# Altium schematic sheet TopLevel.SchDoc
size Tabloid; DrawnBy: V-P.Rheaume@USherbrooke.ca; DocumentNumber: 1; Revision: 1; SheetNumber: 1; SheetTotal: 11; SheetName: Top level
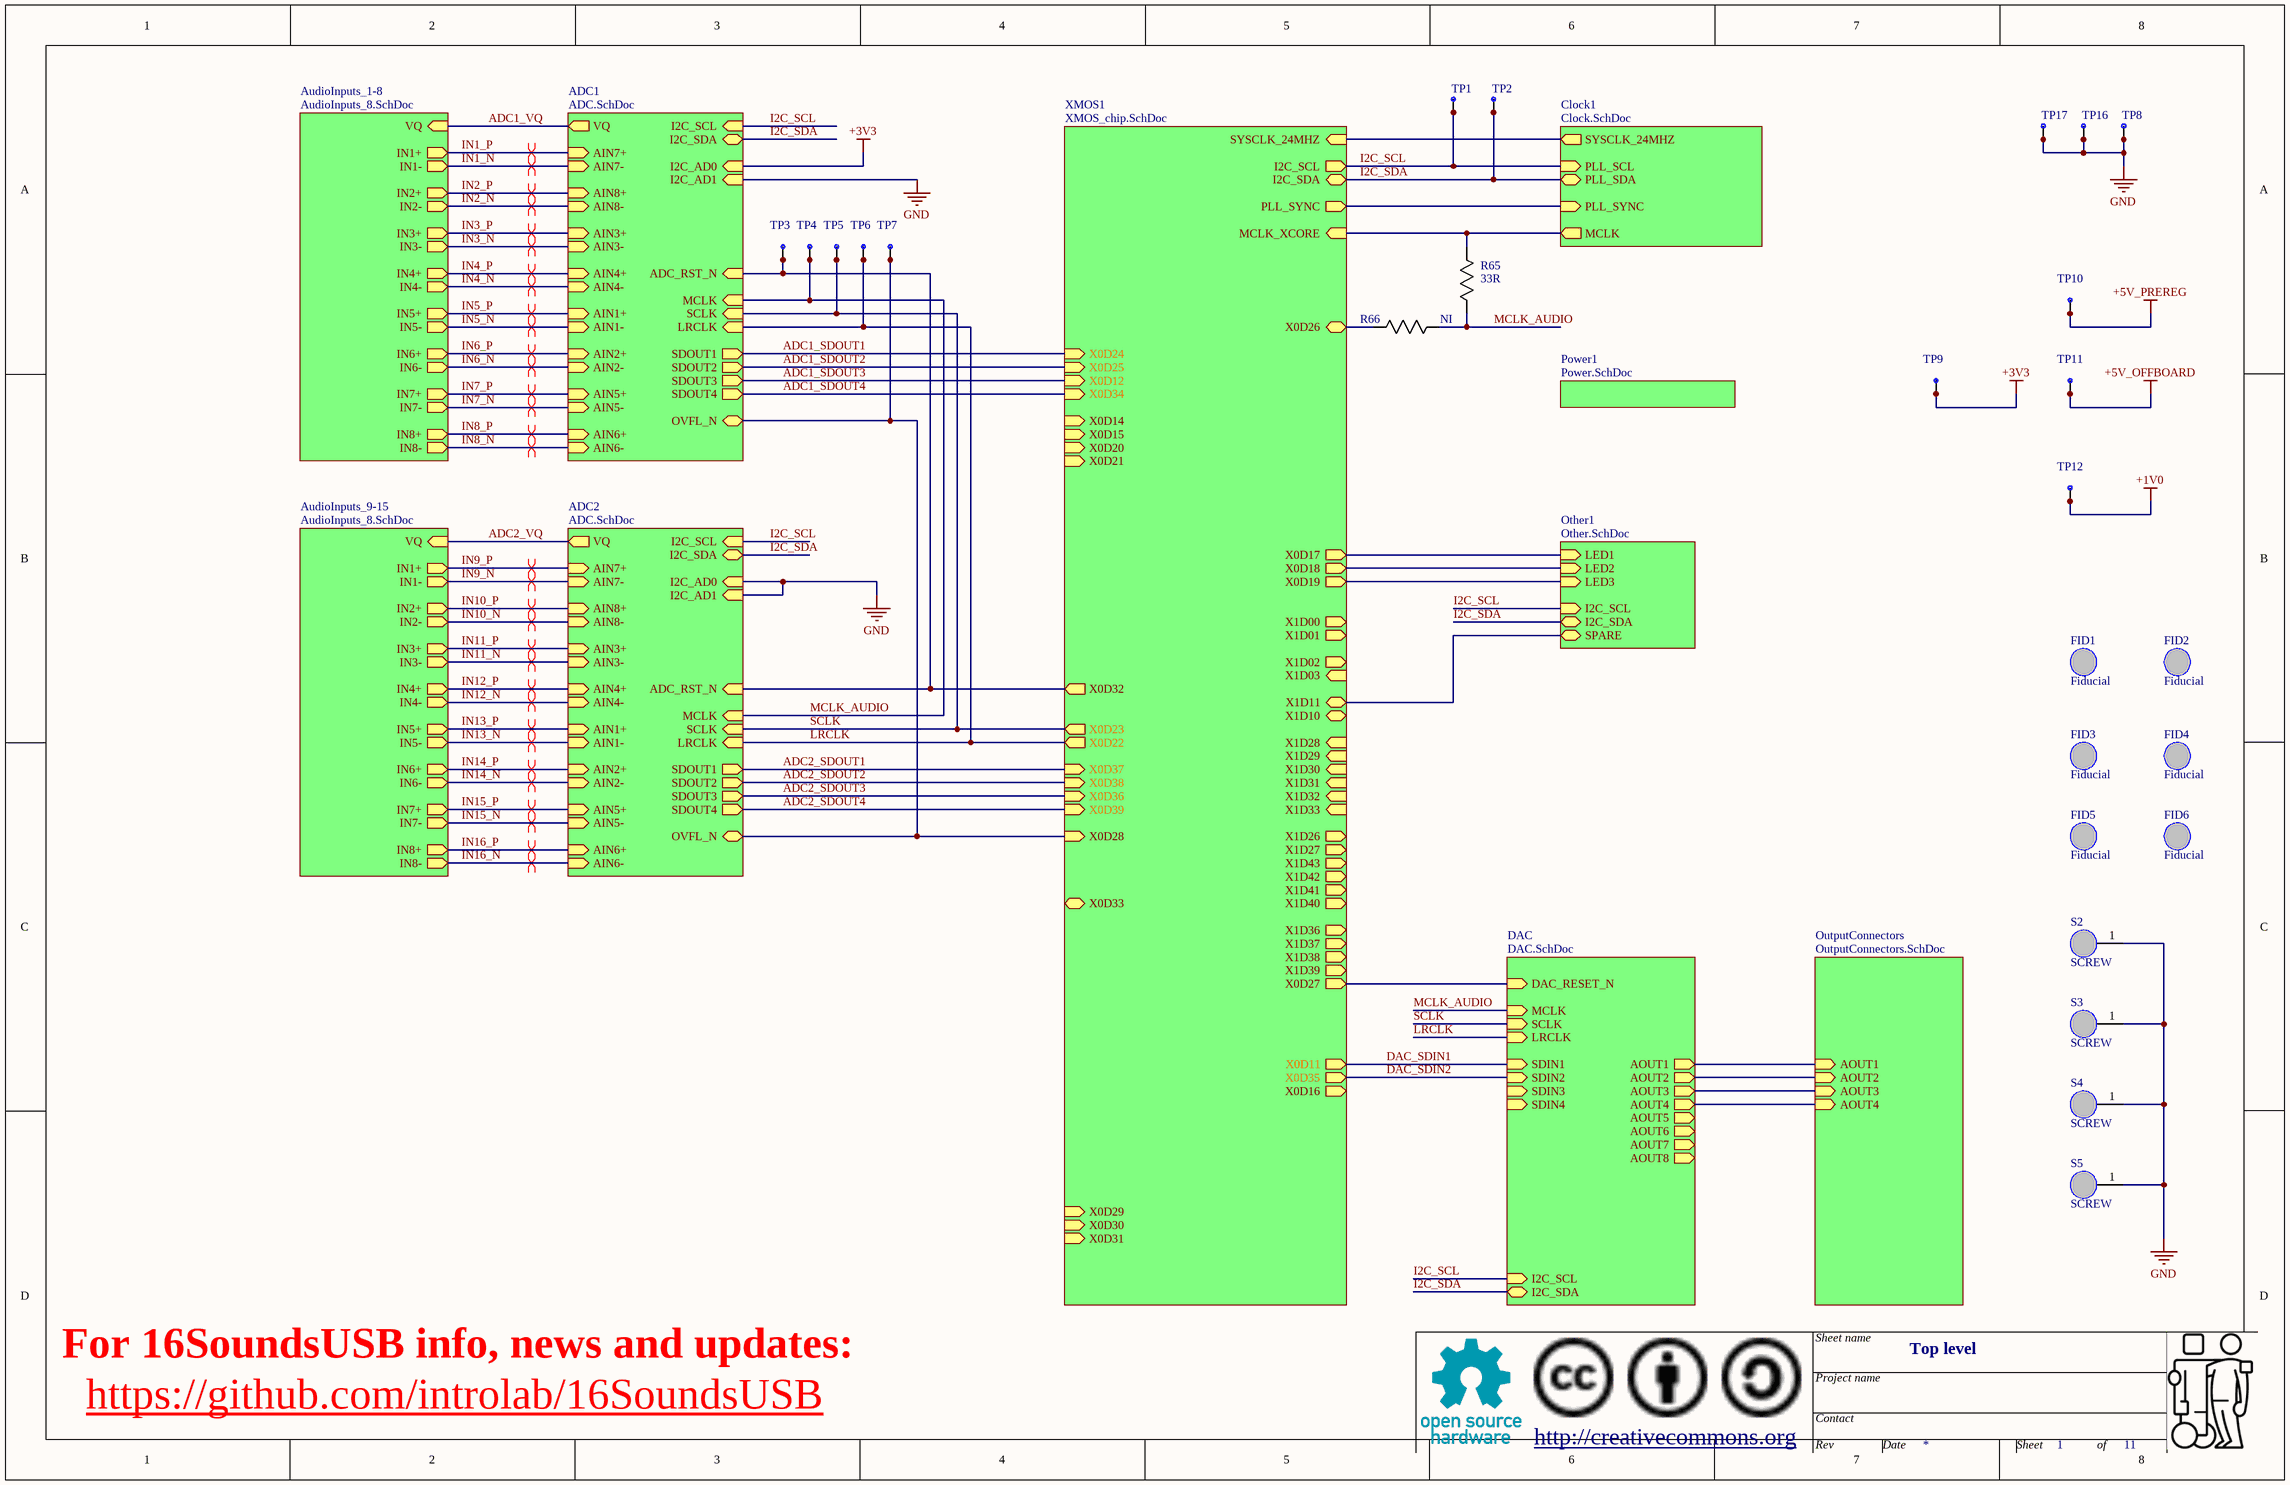
[diagram p0: TopLevel.SchDoc]

## Parts
FID1  Fiducial  [FIDUCIAL]
FID2  Fiducial  [FIDUCIAL]
FID3  Fiducial  [FIDUCIAL]
FID4  Fiducial  [FIDUCIAL]
FID5  Fiducial  [FIDUCIAL]
FID6  Fiducial  [FIDUCIAL]
R65  value 33R  [0603]  (hidden comment: Resistor)
R66  Resistor  [0603]  (value not drawn)
S2  SCREW  [SCREW_4_40]
S3  SCREW  [SCREW_4_40]
S4  SCREW  [SCREW_4_40]
S5  SCREW  [SCREW_4_40]
TP1  TESTPOINT  [0603]  (value not drawn)
TP2  TESTPOINT  [0603]  (value not drawn)
TP3  TESTPOINT  [0603]  (value not drawn)
TP4  TESTPOINT  [0603]  (value not drawn)
TP5  TESTPOINT  [0603]  (value not drawn)
TP6  TESTPOINT  [0603]  (value not drawn)
TP7  TESTPOINT  [0603]  (value not drawn)
TP8  TESTPOINT  [1206]  (value not drawn)
TP9  TESTPOINT  [0603]  (value not drawn)
TP10  TESTPOINT  [0603]  (value not drawn)
TP11  TESTPOINT  [0603]  (value not drawn)
TP12  TESTPOINT  [0603]  (value not drawn)
TP16  TESTPOINT  [1206]  (value not drawn)
TP17  TESTPOINT  [1206]  (value not drawn)

## Sub-sheets
ADC1 = ADC.SchDoc: I2C_SCL (in), I2C_SDA (bidir), I2C_AD1 (in), I2C_AD0 (in), SDOUT1 (out), SDOUT2 (out), SDOUT3 (out), SDOUT4 (out), LRCLK (in), SCLK (in), MCLK (in), ADC_RST_N (in), OVFL_N (bidir), AIN1+ (in), AIN1- (in), AIN2+ (in), AIN2- (in), AIN3+ (in), AIN3- (in), AIN4+ (in), AIN4- (in), AIN5+ (in), AIN5- (in), AIN6+ (in), AIN6- (in), AIN7+ (in), AIN7- (in), AIN8+ (in), AIN8- (in), VQ (out)
ADC2 = ADC.SchDoc: I2C_SCL (in), I2C_SDA (bidir), I2C_AD1 (in), I2C_AD0 (in), SDOUT1 (out), SDOUT2 (out), SDOUT3 (out), SDOUT4 (out), LRCLK (in), SCLK (in), MCLK (in), ADC_RST_N (in), OVFL_N (bidir), AIN1+ (in), AIN1- (in), AIN2+ (in), AIN2- (in), AIN3+ (in), AIN3- (in), AIN4+ (in), AIN4- (in), AIN5+ (in), AIN5- (in), AIN6+ (in), AIN6- (in), AIN7+ (in), AIN7- (in), AIN8+ (in), AIN8- (in), VQ (out)
AudioInputs_1-8 = AudioInputs_8.SchDoc: VQ (in), IN8+ (out), IN8- (out), IN1+ (out), IN1- (out), IN2+ (out), IN2- (out), IN3+ (out), IN3- (out), IN4+ (out), IN4- (out), IN5+ (out), IN5- (out), IN6+ (out), IN6- (out), IN7+ (out), IN7- (out)
AudioInputs_9-15 = AudioInputs_8.SchDoc: VQ (in), IN8+ (out), IN8- (out), IN1+ (out), IN1- (out), IN2+ (out), IN2- (out), IN3+ (out), IN3- (out), IN4+ (out), IN4- (out), IN5+ (out), IN5- (out), IN6+ (out), IN6- (out), IN7+ (out), IN7- (out)
Clock1 = Clock.SchDoc: SYSCLK_24MHZ (out), PLL_SYNC (in), PLL_SCL (in), PLL_SDA (bidir), MCLK (out)
DAC = DAC.SchDoc: LRCLK (in), SCLK (in), MCLK (in), SDIN1 (in), SDIN2 (in), SDIN3 (in), SDIN4 (in), DAC_RESET_N (in), I2C_SCL (in), I2C_SDA (bidir), AOUT1 (out), AOUT2 (out), AOUT3 (out), AOUT4 (out), AOUT5 (out), AOUT6 (out), AOUT7 (out), AOUT8 (out)
Other1 = Other.SchDoc: LED1 (in), LED2 (in), LED3 (in), I2C_SCL (in), I2C_SDA (bidir), SPARE (bidir)
OutputConnectors = OutputConnectors.SchDoc: AOUT1 (in), AOUT2 (in), AOUT3 (in), AOUT4 (in)
Power1 = Power.SchDoc: no entries
XMOS1 = XMOS_chip.SchDoc: SYSCLK_24MHZ (in), MCLK_XCORE (in), I2C_SCL (out), I2C_SDA (bidir), PLL_SYNC (out), X0D14 (in), X0D15 (in), X0D16 (out), X0D17 (out), X0D18 (out), X0D19 (out), X0D20 (in), X0D21 (in), X0D22 (out), X0D23 (out), X0D24 (in), X0D25 (in), X0D27 (out), X0D32 (out), X0D34 (in), X0D35 (out), X0D36 (in), X0D37 (in), X0D38 (in), X0D39 (in), X0D29 (in), X0D28 (in), X0D31 (in), X0D30 (in), X0D33 (bidir), X0D26 (bidir), X1D26 (out), X1D27 (out), X1D28 (in), X1D29 (in), X1D30 (in), X1D31 (in), X1D32 (in), X1D33 (in), X1D43 (out), X1D42 (out), X1D41 (out), X1D40 (out), X1D10 (bidir), X1D11 (bidir), X1D03 (in), X1D02 (out), X1D01 (out), X1D00 (out), X1D37 (out), X1D36 (out), X1D39 (out), X1D38 (out), X0D12 (in), X0D11 (out)

## Nets
+1V0: TP12.1 TP12.2
+3V3: TP9.1 TP9.2 ; sheet ADC1/I2C_AD0
+5V_OFFBOARD: TP11.1 TP11.2
+5V_PREREG: TP10.1 TP10.2
GND: S2.1 S3.1 S4.1 S5.1 TP8.1 TP8.2 TP16.1 TP16.2 TP17.1 TP17.2 ; sheet ADC2/I2C_AD1, sheet ADC2/I2C_AD0, sheet ADC1/I2C_AD1
ADC1_SDOUT1: sheet XMOS1/X0D24, sheet ADC1/SDOUT1
ADC1_SDOUT2: sheet XMOS1/X0D25, sheet ADC1/SDOUT2
ADC1_SDOUT3: sheet XMOS1/X0D12, sheet ADC1/SDOUT3
ADC1_SDOUT4: sheet XMOS1/X0D34, sheet ADC1/SDOUT4
ADC1_VQ: sheet AudioInputs_1-8/VQ, sheet ADC1/VQ
ADC2_SDOUT1: sheet XMOS1/X0D37, sheet ADC2/SDOUT1
ADC2_SDOUT2: sheet XMOS1/X0D38, sheet ADC2/SDOUT2
ADC2_SDOUT3: sheet XMOS1/X0D36, sheet ADC2/SDOUT3
ADC2_SDOUT4: sheet XMOS1/X0D39, sheet ADC2/SDOUT4
ADC2_VQ: sheet AudioInputs_9-15/VQ, sheet ADC2/VQ
DAC_SDIN1: sheet XMOS1/X0D11, sheet DAC/SDIN1
DAC_SDIN2: sheet XMOS1/X0D35, sheet DAC/SDIN2
I2C_SCL: TP1.1 TP1.2 ; sheet XMOS1/I2C_SCL, sheet Clock1/PLL_SCL, sheet ADC2/I2C_SCL, sheet ADC1/I2C_SCL, sheet DAC/I2C_SCL, sheet Other1/I2C_SCL
I2C_SDA: TP2.1 TP2.2 ; sheet XMOS1/I2C_SDA, sheet Clock1/PLL_SDA, sheet ADC2/I2C_SDA, sheet ADC1/I2C_SDA, sheet DAC/I2C_SDA, sheet Other1/I2C_SDA
IN1_N: sheet AudioInputs_1-8/IN1-, sheet ADC1/AIN7-
IN1_P: sheet AudioInputs_1-8/IN1+, sheet ADC1/AIN7+
IN2_N: sheet AudioInputs_1-8/IN2-, sheet ADC1/AIN8-
IN2_P: sheet AudioInputs_1-8/IN2+, sheet ADC1/AIN8+
IN3_N: sheet AudioInputs_1-8/IN3-, sheet ADC1/AIN3-
IN3_P: sheet AudioInputs_1-8/IN3+, sheet ADC1/AIN3+
IN4_N: sheet AudioInputs_1-8/IN4-, sheet ADC1/AIN4-
IN4_P: sheet AudioInputs_1-8/IN4+, sheet ADC1/AIN4+
IN5_N: sheet AudioInputs_1-8/IN5-, sheet ADC1/AIN1-
IN5_P: sheet AudioInputs_1-8/IN5+, sheet ADC1/AIN1+
IN6_N: sheet AudioInputs_1-8/IN6-, sheet ADC1/AIN2-
IN6_P: sheet AudioInputs_1-8/IN6+, sheet ADC1/AIN2+
IN7_N: sheet AudioInputs_1-8/IN7-, sheet ADC1/AIN5-
IN7_P: sheet AudioInputs_1-8/IN7+, sheet ADC1/AIN5+
IN8_N: sheet AudioInputs_1-8/IN8-, sheet ADC1/AIN6-
IN8_P: sheet AudioInputs_1-8/IN8+, sheet ADC1/AIN6+
IN9_N: sheet AudioInputs_9-15/IN1-, sheet ADC2/AIN7-
IN9_P: sheet AudioInputs_9-15/IN1+, sheet ADC2/AIN7+
IN10_N: sheet AudioInputs_9-15/IN2-, sheet ADC2/AIN8-
IN10_P: sheet AudioInputs_9-15/IN2+, sheet ADC2/AIN8+
IN11_N: sheet AudioInputs_9-15/IN3-, sheet ADC2/AIN3-
IN11_P: sheet AudioInputs_9-15/IN3+, sheet ADC2/AIN3+
IN12_N: sheet AudioInputs_9-15/IN4-, sheet ADC2/AIN4-
IN12_P: sheet AudioInputs_9-15/IN4+, sheet ADC2/AIN4+
IN13_N: sheet AudioInputs_9-15/IN5-, sheet ADC2/AIN1-
IN13_P: sheet AudioInputs_9-15/IN5+, sheet ADC2/AIN1+
IN14_N: sheet AudioInputs_9-15/IN6-, sheet ADC2/AIN2-
IN14_P: sheet AudioInputs_9-15/IN6+, sheet ADC2/AIN2+
IN15_N: sheet AudioInputs_9-15/IN7-, sheet ADC2/AIN5-
IN15_P: sheet AudioInputs_9-15/IN7+, sheet ADC2/AIN5+
IN16_N: sheet AudioInputs_9-15/IN8-, sheet ADC2/AIN6-
IN16_P: sheet AudioInputs_9-15/IN8+, sheet ADC2/AIN6+
LRCLK: TP6.1 TP6.2 ; sheet XMOS1/X0D22, sheet ADC2/LRCLK, sheet ADC1/LRCLK, sheet DAC/LRCLK
MCLK_AUDIO: R65.1 R66.2 TP4.1 TP4.2 ; sheet ADC2/MCLK, sheet ADC1/MCLK, sheet DAC/MCLK
SCLK: TP5.1 TP5.2 ; sheet XMOS1/X0D23, sheet ADC2/SCLK, sheet ADC1/SCLK, sheet DAC/SCLK
NetR65_2: R65.2 ; sheet XMOS1/MCLK_XCORE, sheet Clock1/MCLK
NetR66_1: R66.1 ; sheet XMOS1/X0D26
NetTP3_1: TP3.1 TP3.2 ; sheet XMOS1/X0D32, sheet ADC2/ADC_RST_N, sheet ADC1/ADC_RST_N
NetTP7_1: TP7.1 TP7.2 ; sheet XMOS1/X0D28, sheet ADC2/OVFL_N, sheet ADC1/OVFL_N
(unnamed): sheet XMOS1/SYSCLK_24MHZ, sheet Clock1/SYSCLK_24MHZ
(unnamed): sheet XMOS1/PLL_SYNC, sheet Clock1/PLL_SYNC
(unnamed): sheet XMOS1/X0D17, sheet Other1/LED1
(unnamed): sheet XMOS1/X0D18, sheet Other1/LED2
(unnamed): sheet XMOS1/X0D19, sheet Other1/LED3
(unnamed): sheet XMOS1/X0D27, sheet DAC/DAC_RESET_N
(unnamed): sheet XMOS1/X1D11, sheet Other1/SPARE
(unnamed): sheet DAC/AOUT1, sheet OutputConnectors/AOUT1
(unnamed): sheet DAC/AOUT2, sheet OutputConnectors/AOUT2
(unnamed): sheet DAC/AOUT3, sheet OutputConnectors/AOUT3
(unnamed): sheet DAC/AOUT4, sheet OutputConnectors/AOUT4

Not connected (* = marked no-connect by the designer): FID1 0; FID2 0; FID3 0; FID4 0; FID5 0; FID6 0

## Layout directives
differential pair: IN1_N, IN1_P, IN2_N, IN2_P, IN3_N, IN3_P, IN4_N, IN4_P, IN5_N, IN5_P, IN6_N, IN6_P, IN7_N, IN7_P, IN8_N, IN8_P, IN9_N, IN9_P, IN10_N, IN10_P, IN11_N, IN11_P, IN12_N, IN12_P, IN13_N, IN13_P, IN14_N, IN14_P, IN15_N, IN15_P, IN16_N, IN16_P

## Notes on the sheet
- For 16SoundsUSB info, news and updates:
- https://github.com/introlab/16SoundsUSB
- Sheet name
- http://creativecommons.org
- Project name
- Contact
- Rev
- Date
- Sheet
- of

## Library data of the parts
R66 = Resistor: Value: 33R; HelpURL: *; Mfg: *; Mfg_PN: *; NI: NI; Supplier1: *; Supplier1_PN: *; Type: *; Rating: *; Tolerance: *
S2-S5 = SCREW: Screw hole; HelpURL: *; Mfg: *; Mfg_PN: *; NI: NI; Rating: *; Supplier1: *; Supplier1_PN: *; Tolerance: *; Type: *; Value: *
TP1-TP7 TP9-TP12 = TESTPOINT: Test point; Mfg: TE; Mfg_PN: RCU-0C; HelpURL: *; NI: *; Rating: *; Supplier1: Digikey; Supplier1_PN: A106145CT-ND; Tolerance: *; Type: *; Value: *
TP8 TP16 TP17 = TESTPOINT: Test point; Mfg: Harwin; Mfg_PN: S1751-46; HelpURL: *; NI: *; Rating: *; Supplier1: Digikey; Supplier1_PN: 952-3024-ND; Tolerance: *; Type: *; Value: *
FID1-FID6 = Fiducial: HelpURL: *; Mfg: *; Mfg_PN: *; NI: NI; Rating: *; Supplier1: *; Supplier1_PN: *; Tolerance: *; Type: *; Value: *
R65 = Resistor: HelpURL: *; Mfg: *; Mfg_PN: *; NI: *; Supplier1: *; Supplier1_PN: *; Type: *; Rating: *; Tolerance: *